# EAGLE board tesla3rtm (EAGLE 7.6.0), part 1 of 3
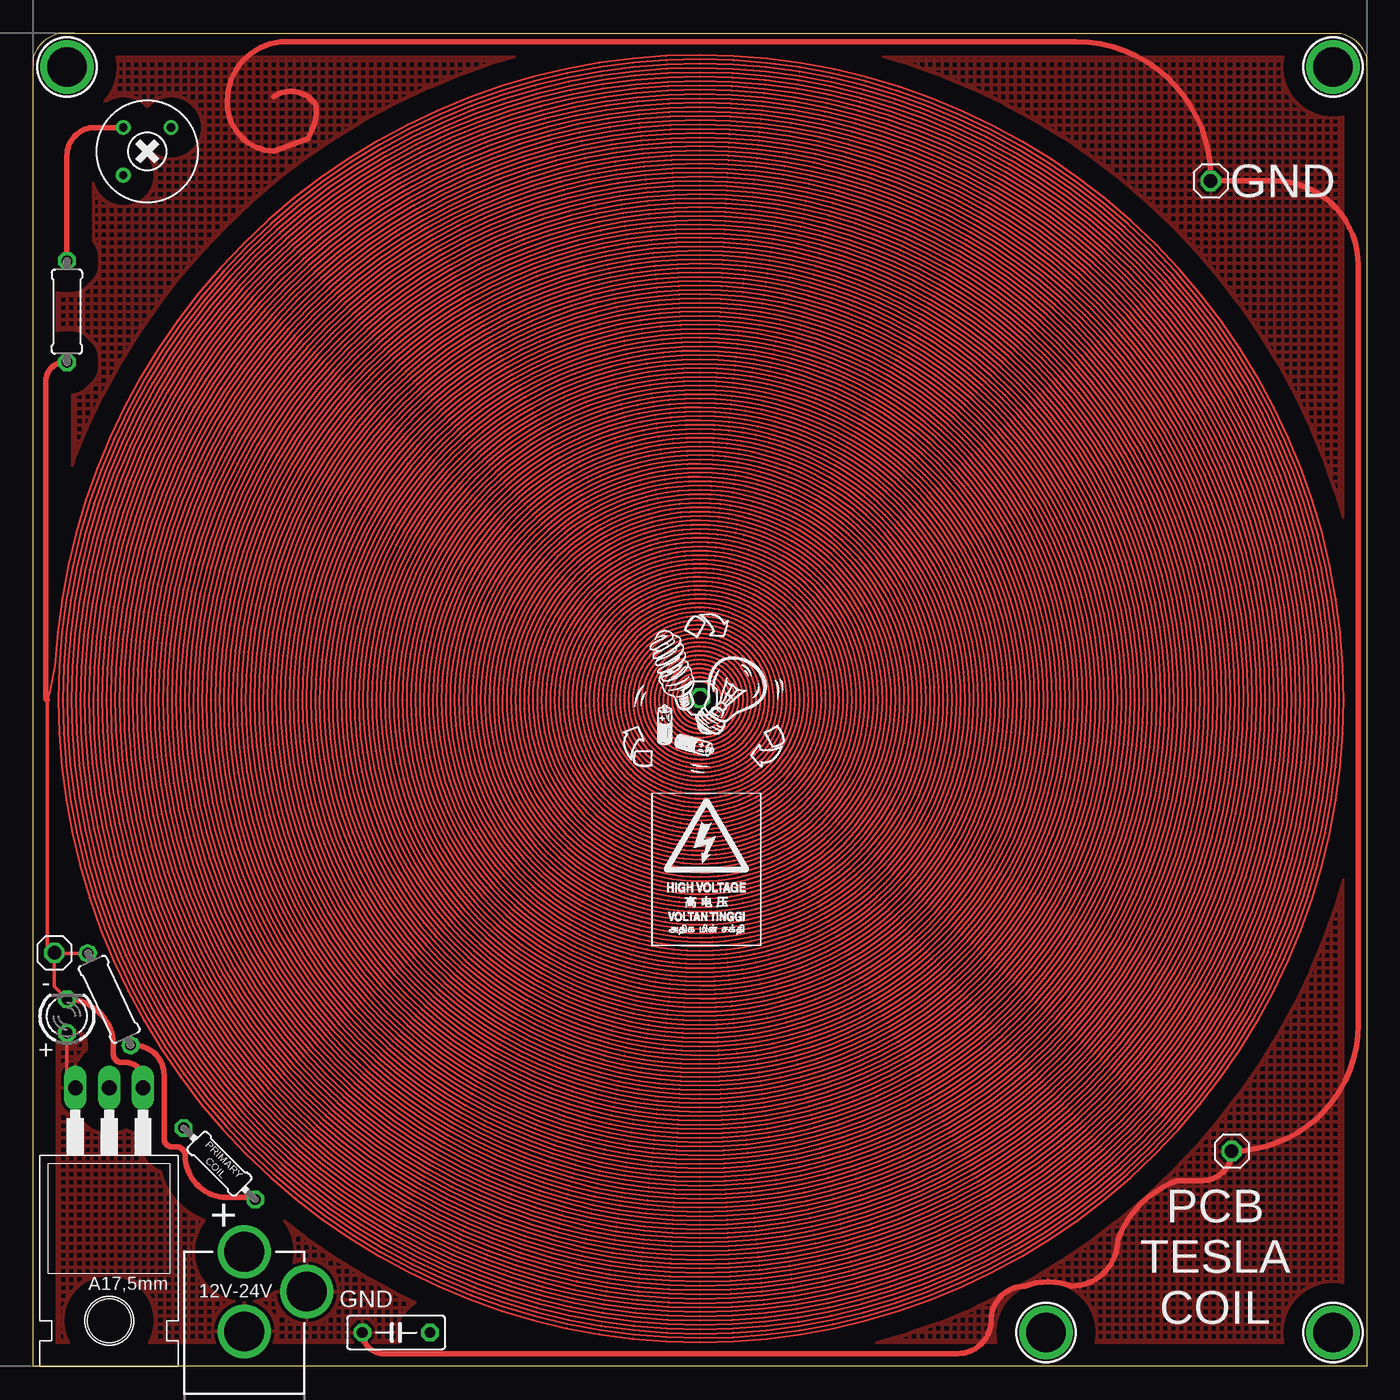
[diagram p1: board, top side]
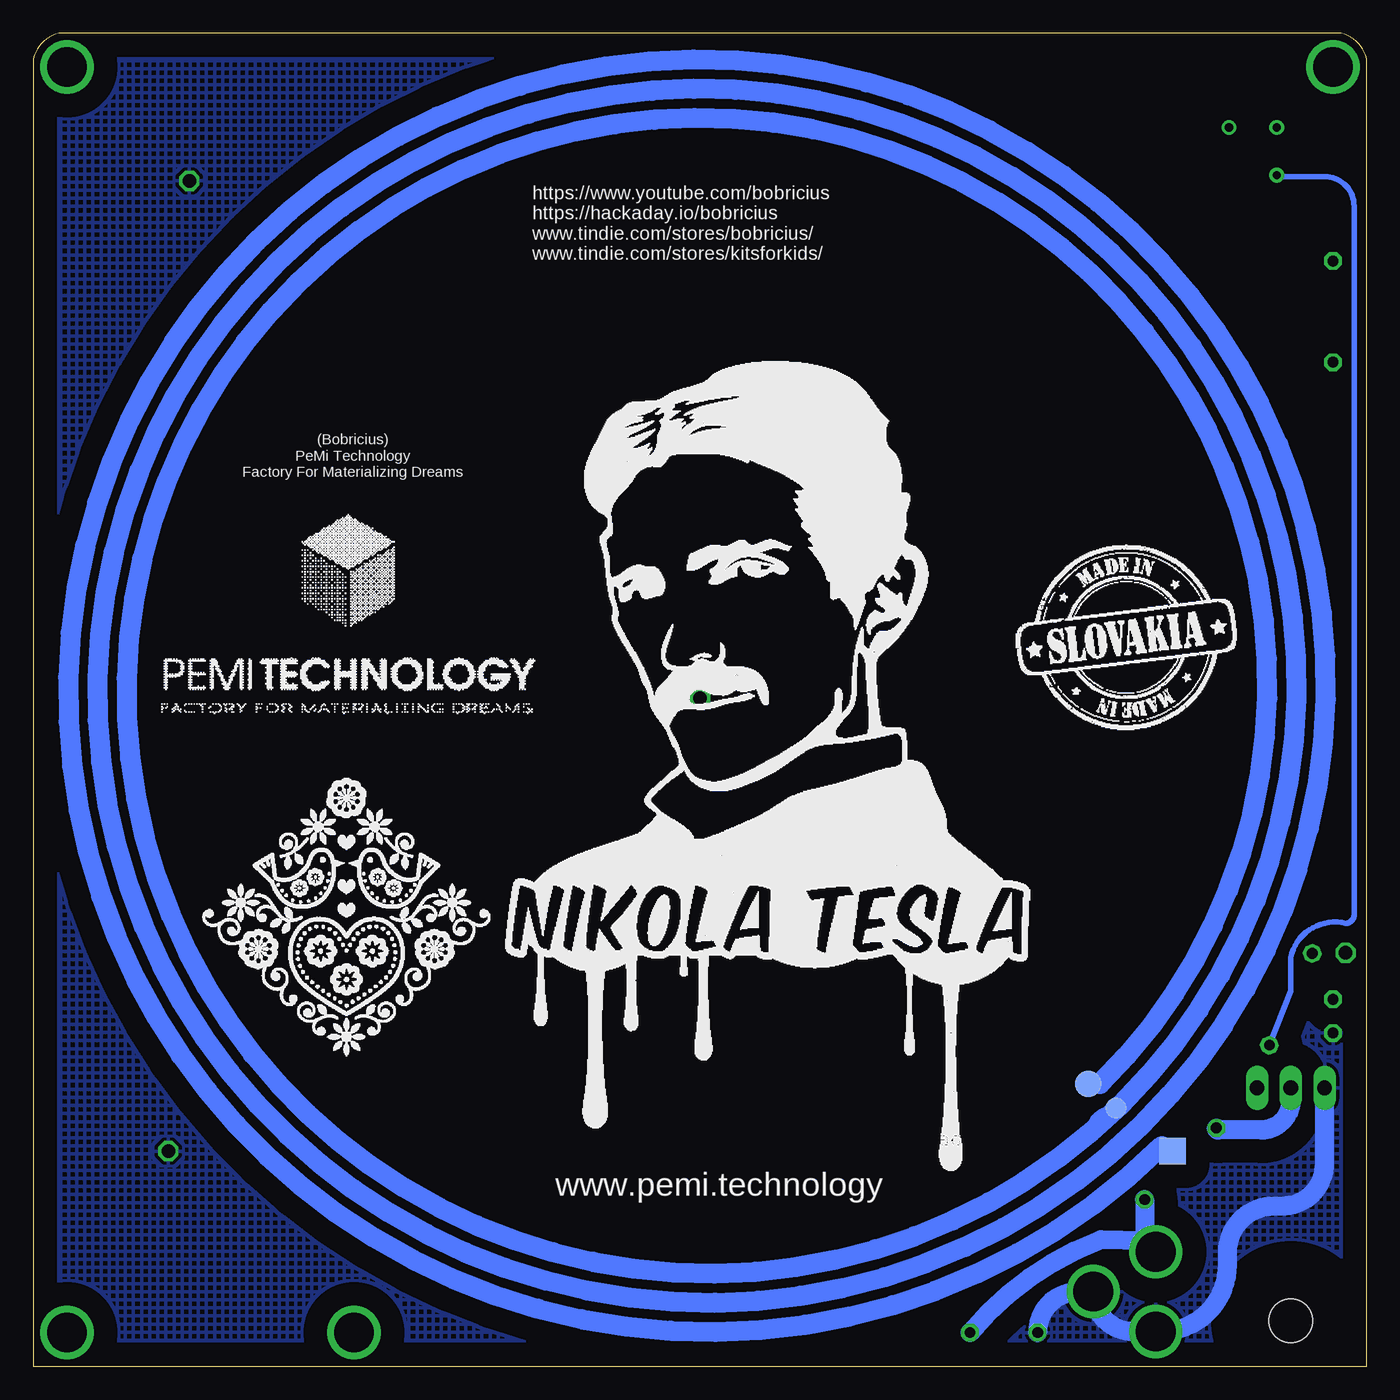
[diagram p2: board, bottom side, seen from below]

Size 100.33 x 100.33 mm. Coordinates in mm from the lower left corner, seen from the top.
Outline: 0,98.43 arc-59 1.91,100.33 98.43,100.33 arc-59 100.33,98.43 100.33,0 0,0 0,98.43
Copper layers (1*16): Top 0.035mm / dielectric 1.5mm / Bottom 0.035mm
Design rules "hackvana": minimum track width 6mil, minimum drill 0.3mm, track to track 6mil, track to pad 6mil, pad to pad 6mil, via to via 6mil, smd to smd 0mil, copper to edge 6mil, drill to drill 6mil, minimum pad ring 10mil, minimum via ring 6mil, stop-mask expansion 2mil, vias tented up to drill 100mil, thermal gap 10mil

## Footprints (pad centres in the part's own frame; a part is rotated, then mirrored left to right if it is on the bottom)
C050-025X075 = drill 0.813 octagon: 1 -2.54,0; 2 2.54,0
POWER_JACK_PTH = drill 2.997: GND 0,7.7; GNDBREAK 4.7,10.7; PWR 0,13.7
1X01 = drill 1.016 octagon: 1 0,0
0204/7 = drill 0.813 octagon: 1 -3.81,0; 2 3.81,0
LED3MM = drill 0.813 octagon: A -1.27,0; K 1.27,0
RTRIM3339P = drill 0.61: 1 -2.54,0; 2 0,-2.54; 3 2.54,0
0207/7 = drill 0.813 octagon: 1 -3.81,0; 2 3.81,0
TO220 = drill 1.118 long: 1 -2.54,-6.35; 2 0,-6.35; 3 2.54,-6.35 | hole 3.302: 0,11.176
TP20SQ = smd 2 x 2: TP 0,0
TP16R = smd 1.6 x 1.6: TP 0,0
TP20R = smd 2 x 2: TP 0,0
MOUNTINGHOLE_3.0_PLATEDTHIN = drill 3 pad 3.6: P$1 0,0

## Placement (x,y rotation side)
C1  1u  [C050-025X075]  27.31,2.54 180 top
J1  POWER_JACKPTH  [POWER_JACK_PTH]  15.88,-5.08 0 top
L2  350T Coil  [1X01]  1.59,31.12 0 top
L3  350T Coil  [1X01]  50.17,50.29 0 top
L4  350T Coil  [1X01]  88.58,89.22 0 top
L5  350T Coil  [1X01]  90.17,16.19 0 top
L8  1T Wire  [0204/7]  14.02,15.24 135 top
LED1  [LED3MM]  2.54,26.35 90 top
R1  [RTRIM3339P]  8.57,91.44 225 top
R2  10k  [0207/7]  2.54,79.38 90 top
R4  10k  [0207/7]  5.72,27.62 295 top
T1  [TO220]  5.72,14.61 180 top
TP1  TPTP20SQ  [TP20SQ]  14.61,16.19 270 bottom
TP2  TPTP16R  [TP16R]  18.86,19.43 0 bottom
TP3  TPTP20R  [TP20R]  20.96,21.27 270 bottom
U$1  MOUNTINGHOLE3.0THIN  [MOUNTINGHOLE_3.0_PLATEDTHIN]  2.54,97.79 0 top
U$2  MOUNTINGHOLE3.0THIN  [MOUNTINGHOLE_3.0_PLATEDTHIN]  97.79,97.79 0 top
U$3  MOUNTINGHOLE3.0THIN  [MOUNTINGHOLE_3.0_PLATEDTHIN]  76.2,2.54 0 top
U$4  MOUNTINGHOLE3.0THIN  [MOUNTINGHOLE_3.0_PLATEDTHIN]  97.79,2.54 0 top
U$5  [HV03]  46.51,31.62 0 top

## Tracks (layer width: path | path; a pad name or v marks a point on that pad's centre or on a via)
GND
  Top 0.254: LED1.A 2.54,21.59 T1.3
  Top 0.406: C1.2 arc90 26.35,0.95 69.53,0.95 arc90 72.07,3.49 arc-90 74.61,6.03 arc-42 78.11,6.03 arc90 81.6,9.53 arc-49 86.04,13.97 87.95,13.97 arc90 L5.1 arc90 99.69,25.72 99.69,82.87 arc90 93.35,89.22 L4.1 88.58,89.53 arc90 78.42,99.69 19.05,99.69 arc90 14.61,95.25 arc90 18.1,91.44 20.64,92.39 arc39 21.27,94.93 arc90 18.1,95.57
  Bottom 1.422: C1.2 arc90 21.69,5.62 J1.GNDBREAK arc-90 17.58,2.62 J1.GND 15.48,2.62 arc-90 10.48,7.62 10.48,8.57 arc90 6.99,12.06 6.35,12.06 arc-90 3.18,15.24 T1.3
  pour Bottom (isolate 1.778, hatched): 0,100.33 100.33,100.33 100.33,0 0,0
  pour Top (isolate 1.676, hatched): 100.33,100.33 0,100.33 0,0 100.33,0
HV1